# Altium schematic sheet GLCD 128x64 v2.SchDoc
size A
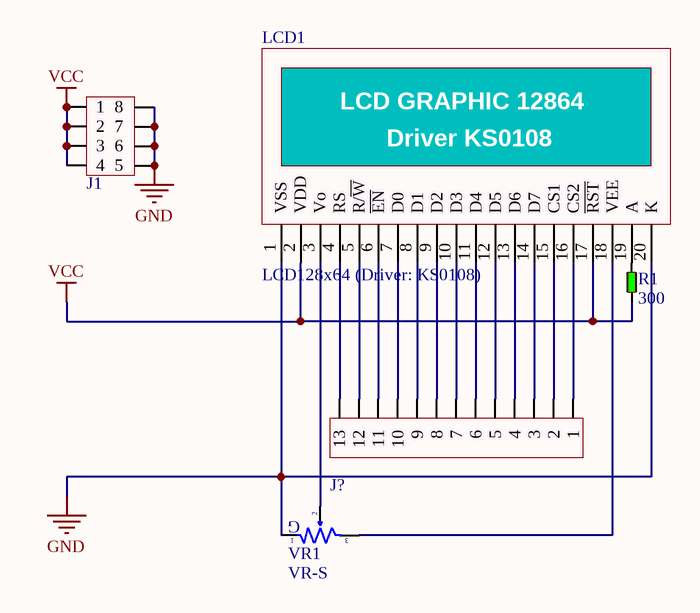
[diagram p0: GLCD 128x64 v2.SchDoc]

## Parts
J1  JP4x2  [JP4-D2T]  (value not drawn)
J?  JP13  [JP13-D1T]  (value not drawn)
LCD1  LCD128x64 (Driver: KS0108)  [LCD128x64]
R1  300  [R0805]
VR1  VR-S  [VR-S2]

## Nets
GND: J1.5 J1.6 J1.7 J1.8 LCD1.1(VSS) LCD1.20(K) VR1.1
VCC: J1.1 J1.2 J1.3 J1.4 LCD1.2(VDD) LCD1.17(~{RST}) R1.2
NetJ?_1: J?.1 LCD1.16(CS2)
NetJ?_2: J?.2 LCD1.15(CS1)
NetJ?_3: J?.3 LCD1.14(D7)
NetJ?_4: J?.4 LCD1.13(D6)
NetJ?_5: J?.5 LCD1.12(D5)
NetJ?_6: J?.6 LCD1.11(D4)
NetJ?_7: J?.7 LCD1.10(D3)
NetJ?_8: J?.8 LCD1.9(D2)
NetJ?_9: J?.9 LCD1.8(D1)
NetJ?_10: J?.10 LCD1.7(D0)
NetJ?_11: J?.11 LCD1.6(~{EN})
NetJ?_12: J?.12 LCD1.5(R/~{W})
NetJ?_13: J?.13 LCD1.4(RS)
NetLCD1_3: LCD1.3(Vo) VR1.2
NetLCD1_18: LCD1.18(VEE) VR1.3
NetLCD1_19: LCD1.19(A) R1.1

## Notes on the sheet
- (in symbol LCD128x64 (Driver: KS0108)) LCD GRAPHIC 12864; Driver KS0108
- (in symbol VR-S) G

## Library data of the parts
J1 = JP4x2: WR-PHD 2.54 mm Dual Socket Header
J? = JP13: WR-PHD 2.54 mm Angled Socket Header
LCD1 = LCD128x64 (Driver: KS0108): GLCD 128x64 (Driver: KS0108)
R1 = Res-SMD: RES SMD 0.0 OHM JUMPER 1/8W 0805
VR1 = VR-S: Var Resistor